# Altium schematic sheet SUBBOARD-phase_leg_3p_2L.SchDoc
size A4
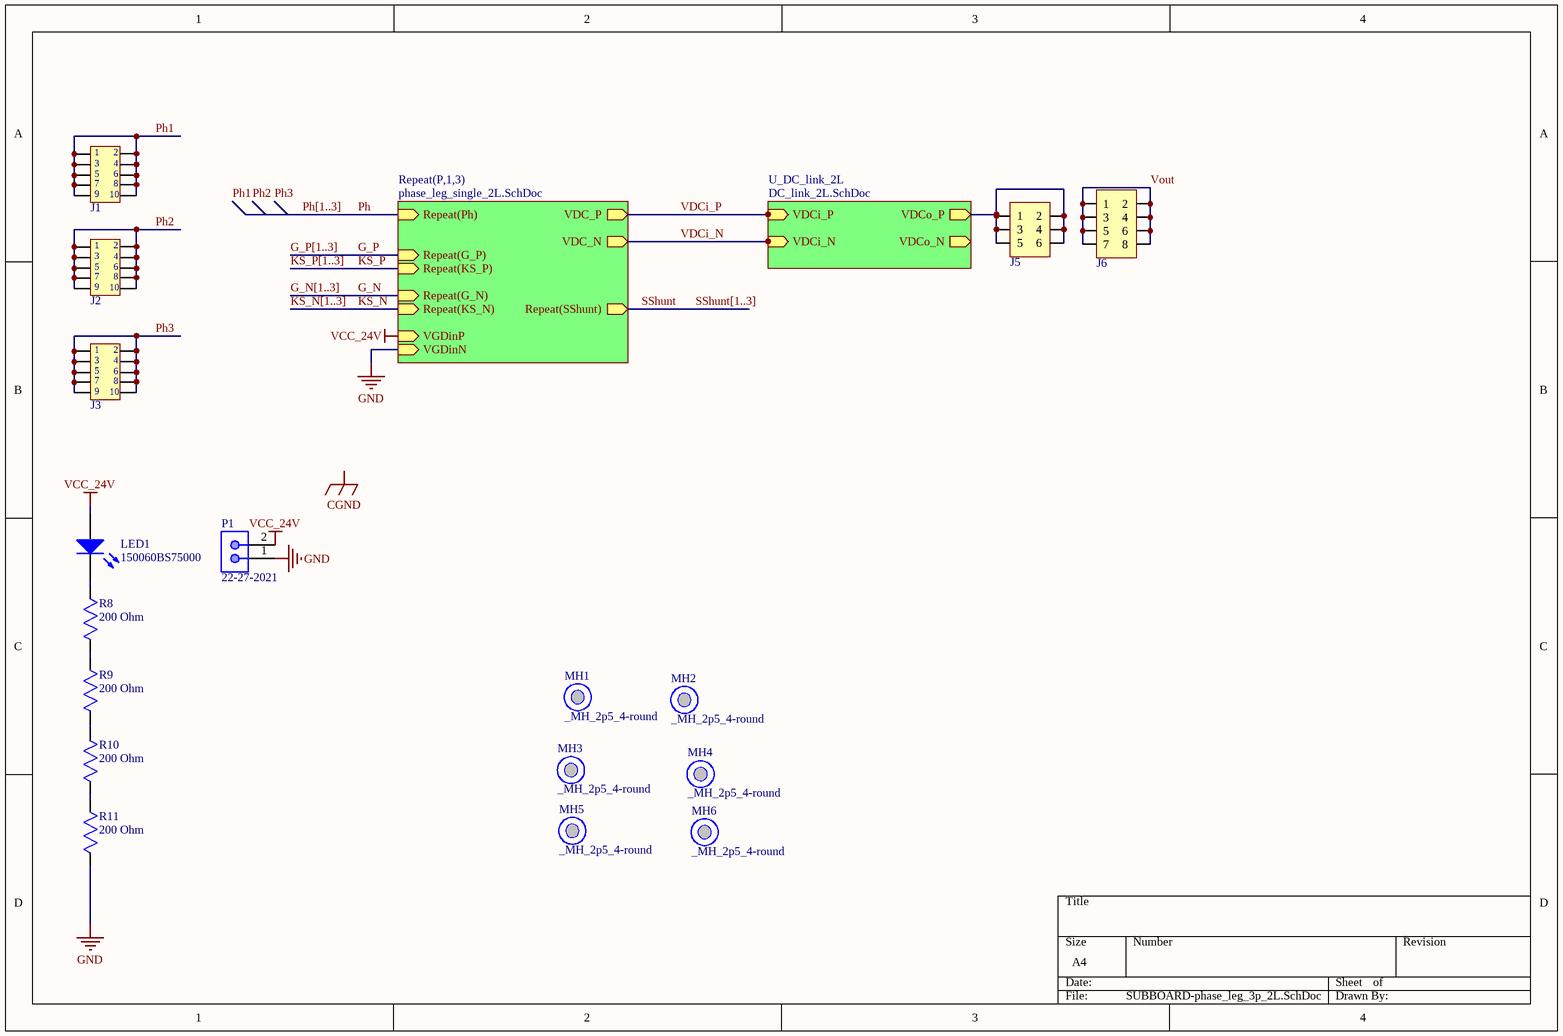
[diagram p0: SUBBOARD-phase_leg_3p_2L.SchDoc]

## Parts
J1  IPS1-105-01-L-D-RA  [IPS1-105-01-L-D-RA]  (value not drawn)
J2  IPS1-105-01-L-D-RA  [IPS1-105-01-L-D-RA]  (value not drawn)
J3  IPS1-105-01-L-D-RA  [IPS1-105-01-L-D-RA]  (value not drawn)
J5  SSW-103-01-G-D  [SSW-103-01-G-D]  (value not drawn)
J6  SSW-104-01-G-D  [SSW-104-01-G-D]  (value not drawn)
LED1  150060BS75000  [0603_A]
MH1  _MH_2p5_4-round  [_MH_2p5_4-round]
MH2  _MH_2p5_4-round  [_MH_2p5_4-round]
MH3  _MH_2p5_4-round  [_MH_2p5_4-round]
MH4  _MH_2p5_4-round  [_MH_2p5_4-round]
MH5  _MH_2p5_4-round  [_MH_2p5_4-round]
MH6  _MH_2p5_4-round  [_MH_2p5_4-round]
P1  22-27-2021  [MOLX-22-27-2021_V]
R8  200 Ohm  [CRCW0603200RFKEAHP]
R9  200 Ohm  [CRCW0603200RFKEAHP]
R10  200 Ohm  [CRCW0603200RFKEAHP]
R11  200 Ohm  [CRCW0603200RFKEAHP]

## Sub-sheets
Repeat(P,1,3) = phase_leg_single_2L.SchDoc: VDC_P (out), VDC_N (out), Repeat(Ph) (in), Repeat(G_P) (in), Repeat(KS_P) (in), Repeat(G_N) (in), Repeat(KS_N) (in), Repeat(SShunt) (out), VGDinP (in), VGDinN (in)
U_DC_link_2L = DC_link_2L.SchDoc: VDCo_P (out), VDCo_N (out), VDCi_P (in), VDCi_N (in)

## Nets
GND: P1.1 R11.2 ; sheet Repeat(P,1,3)/VGDinN
VCC_24V: LED1.2(A) P1.2 ; sheet Repeat(P,1,3)/VGDinP
G_N: sheet Repeat(P,1,3)/Repeat(G_N)
G_P: sheet Repeat(P,1,3)/Repeat(G_P)
KS_N: sheet Repeat(P,1,3)/Repeat(KS_N)
KS_P: sheet Repeat(P,1,3)/Repeat(KS_P)
Ph: sheet Repeat(P,1,3)/Repeat(Ph)
Ph1: J1.1 J1.2 J1.3 J1.4 J1.5 J1.6 J1.7 J1.8 J1.9 J1.10
Ph2: J2.1 J2.2 J2.3 J2.4 J2.5 J2.6 J2.7 J2.8 J2.9 J2.10
Ph3: J3.1 J3.2 J3.3 J3.4 J3.5 J3.6 J3.7 J3.8 J3.9 J3.10
SShunt: sheet Repeat(P,1,3)/Repeat(SShunt)
VDCi_N: sheet U_DC_link_2L/VDCi_N, sheet Repeat(P,1,3)/VDC_N
VDCi_P: sheet U_DC_link_2L/VDCi_P, sheet Repeat(P,1,3)/VDC_P
Vout: J6.1 J6.2 J6.3 J6.4 J6.5 J6.6 J6.7 J6.8
NetJ5_1: J5.1 J5.2 J5.3 J5.4 J5.5 J5.6 ; sheet U_DC_link_2L/VDCo_P
NetLED1_1: LED1.1(K) R8.1
NetR8_2: R8.2 R9.1
NetR9_2: R9.2 R10.1
NetR10_2: R10.2 R11.1

## Buses and harness runs
bus G_N[1..3]
bus G_P[1..3]
bus KS_N[1..3]
bus KS_P[1..3]
bus Ph[1..3]
bus SShunt[1..3]

## Notes on the sheet
- Labels drawn without touching a wire or pin: CGND, Ph1, Ph2, Ph3

## Library data of the parts
J1-J3 = IPS1-105-01-L-D-RA: SAMTEC         IPS1-105-01-L-D-RA             Board-To-Board Connector, Right Angle, IPS1 Series, 10 Contacts, Receptacle, 2.54 mm, Through Hole; Number of Contacts: 10; Number of Ports: 1; Max Voltage Rating (AC): 550V; Current Rating: 9A; Voltage Rating: 777V; Pitch: 2.54mm; Supplier 1: Digi-Key; Manufacturer: Samtec; Manufacturer Part Number: IPS1-105-01-L-D-RA; RoHS: Yes; Category: Connectors; Stock 1: 364; Pricing 1: 1=2.75000, 10=2.64000, 100=2.20000, 500=1.87000, 1000=1.59500, 5000=1.43000 (USD); Mount: Through Hole,Surface Mount; Number of Terminals: 10; Contact Material: Bronze; Contact Plating: Gold; Housing Material: Polymer; Min Operating Temperature: -55°C; Max Operating Temperature: 125°C; Termination: Solder; Orientation: Right Angle; Packaging: Bulk; Gender: Receptacle; Number of Rows: 2; Length: 13.08mm; Depth: 8.51mm; Radiation Hardening: No; REACH SVHC: No SVHC; ComponentLink1URL: https://datasheet.ciiva.com/25618/0900766b8114c2ed-25618027.pdf?src-supplier=RSComponents; ComponentLink1Description: https://datasheet.ciiva.com/25618/0900766b8114c2ed-25618027.pdf?src-supplier=RSComponents; ComponentLink2URL: https://datasheet.ciiva.com/9444/ipt1-9444586.pdf?src-supplier=Avnet; ComponentLink2Description: https://datasheet.ciiva.com/9444/ipt1-9444586.pdf?src-supplier=Avnet; Supplier Part Number 1: SAM9620-ND
J5 = SSW-103-01-G-D: Conn Socket Strip SKT 6 POS 2.54mm Solder ST Thru-Hole; Manufacturer: Samtec; Number of Contacts: 6; Gender: Receptacle; Connector Type: Receptacle,Socket; Contact Resistance: 10mR; Max Current Rating: 6.9A; Max Voltage Rating (AC): 550V; Mating Cycles: 100; Row Spacing: 0.1inch; Supplier 1: Digi-Key; Manufacturer Part Number: SSW-103-01-G-D; RoHS: Yes; Category: Headers and Wire Housings; Stock 1: 1397; Pricing 1: 1=0.93000, 10=0.82100, 25=0.77240, 50=0.74020, 100=0.70800, 250=0.64368, 500=0.57932 (USD); Mount: Through Hole; Contact Plating: Gold; Contact Material: Bronze; Color: Black; Housing Color: Black; Housing Material: Polymer; Min Operating Temperature: -55°C; Max Operating Temperature: 125°C; Number of Rows: 2; Termination: Solder; Packaging: Bulk; Number of Positions: 6; Orientation: Vertical; Current Rating: 6.9A; Voltage Rating: 550V; Length: 8.13mm; Pitch: 2.54mm; Depth: 4.95mm; Radiation Hardening: No; Lead Free: Lead Free; REACH SVHC: No SVHC; ComponentLink1URL: https://datasheet.ciiva.com/25617/0900766b8115c03d-25617399.pdf?src-supplier=RSComponents; ComponentLink1Description: https://datasheet.ciiva.com/25617/0900766b8115c03d-25617399.pdf?src-supplier=RSComponents; ComponentLink2URL: https://datasheet.ciiva.com/22677/82032-22677622.pdf?src-supplier=Element14; ComponentLink2Description: https://datasheet.ciiva.com/22677/82032-22677622.pdf?src-supplier=Element14; ComponentLink3URL: https://datasheet.ciiva.com/749/ssw-1xx-xx-xxx-x-xx-xxx-xx-mkt-749828.pdf?src-supplier=Digi-Key; ComponentLink3Description: https://datasheet.ciiva.com/749/ssw-1xx-xx-xxx-x-xx-xxx-xx-mkt-749828.pdf?src-supplier=Digi-Key; Supplier Part Number 1: SAM1208-03-ND; Supplier 2: Arrow; Stock 2: 1; Pricing 2: 1=0.94640, 1=0.93000, 4167=0.71590, 8334=0.59720, 41667=0.52200, 83334=0.49330 (USD); Supplier 3: Mouser; Stock 3: 388; Pricing 3: 1=1.35000, 10=1.10000, 100=0.98200, 250=0.91700, 500=0.79200, 1000=0.69000 (USD); Supplier Part Number 2: SSW-103-01-G-D; Supplier Part Number 3: 200-SSW10301GD
J6 = SSW-104-01-G-D: Conn Socket Strip SKT 8 POS 2.54mm Solder ST Thru-Hole; Manufacturer: Samtec; Number of Contacts: 8; Max Current Rating: 6.9A; Contact Resistance: 10mR; Max Voltage Rating (AC): 550V; Gender: Receptacle; Connector Type: Receptacle,Socket; Mating Cycles: 100; Row Spacing: 0.1inch; Supplier 1: Digi-Key; Manufacturer Part Number: SSW-104-01-G-D; RoHS: Yes; Category: Headers and Wire Housings; Stock 1: 1152; Pricing 1: 1=1.24000, 10=1.09400, 25=1.03000, 50=0.98700, 100=0.94410, 250=0.85824, 500=0.77242 (USD); Mount: Through Hole; Contact Plating: Gold; Contact Material: Bronze; Color: Black; Housing Color: Black; Housing Material: Polymer; Min Operating Temperature: -55°C; Max Operating Temperature: 125°C; Number of Rows: 2; Termination: Solder; Packaging: Bulk; Orientation: Vertical; Number of Positions: 8; Current Rating: 6.9A; Voltage Rating: 550V; Length: 10.67mm; Pitch: 2.54mm; Depth: 4.95mm; Radiation Hardening: No; Lead Free: Lead Free; REACH SVHC: No SVHC; ComponentLink1URL: https://datasheet.ciiva.com/25617/0900766b8115c03d-25617355.pdf?src-supplier=RSComponents; ComponentLink1Description: https://datasheet.ciiva.com/25617/0900766b8115c03d-25617355.pdf?src-supplier=RSComponents; ComponentLink2URL: https://datasheet.ciiva.com/22677/82032-22677624.pdf?src-supplier=Element14; ComponentLink2Description: https://datasheet.ciiva.com/22677/82032-22677624.pdf?src-supplier=Element14; ComponentLink3URL: https://datasheet.ciiva.com/749/ssw-1xx-xx-xxx-x-xx-xxx-xx-mkt-749827.pdf?src-supplier=Digi-Key; ComponentLink3Description: https://datasheet.ciiva.com/749/ssw-1xx-xx-xxx-x-xx-xxx-xx-mkt-749827.pdf?src-supplier=Digi-Key; Supplier Part Number 1: SAM1208-04-ND
LED1 = CMP-1426-00003-1: SMD mono-color Chip LED, WL-SMCW, Blue; Manufacturer: Wuerth Elektronik; Color: Blue; ComponentLink2Description: Datasheet; ComponentLink2URL: http://katalog.we-online.com/led/datasheet/150060BS75000.pdf; ComponentLink1URL: http://www.we-online.com; PackageReference: 0603_A; PartNumber: 150060BS75000; ComponentLink1Description: Manufacturer URL
MH1-MH6 = _MH_2p5_4-round: matching hole 2.5 hole, 4mm pad (round)
P1 = CMP-2000-05537-1: Male Header, Pitch 2.54 mm, 1 x 2 Position, Height 11.7 mm, Tail Length 3.56 mm, 0 to 75 degC, RoHS, Bulk; Manufacturer: Molex; PartNumber: 0022272021; Current rating: 4A; Package Version: Rev. BC, 02/2012; Voltage rating: 250V; No. of Positions: 2; Pitch: 2.54mm; No. of Rows: 1; Orientation: Vertical; Operating temperature: 0°Cto+75°C; Manufacturer URL: http://www.molex.com/; Mounting Technology: ThroughHole; Housing material: Nylon(UL94V-0); Package Description: 2-Leads Header, Body 5.08 x 5.8 mm, Pitch 2.54 mm; Voltage - Max: 250V; Datasheet URL: http://www.molex.com/pdm_docs/sd/022272021_sd.pdf; Package Reference: 22-27-2021; Contact material: Tinplatedbrass; Current - Max: 4A; Datasheet Version: Rev. F, 06/2009
R8-R11 = CRCW0603200RFKEAHP: CRCW0603200RFKEAHP / Res Thick Film 0603 200 Ohm 1% 0.25W(1/4W) ±100ppm/C Pad SMD Automotive T/R; Manufacturer: Vishay Dale; Resistance: 200R; Power Rating: 250mW; Temperature Coefficient: 100ppm/°C; Supplier 1: Digi-Key; Manufacturer Part Number: CRCW0603200RFKEAHP; RoHS: Yes; Category: Chip SMD Resistors; Stock 1: 59007; Pricing 1: 1=0.15000, 10=0.12900, 100=0.05030, 1000=0.02106, 2500=0.01930 (USD); Mount: Surface Mount; Case/Package: 0603; Case Code (Imperial): 0603; Case Code (Metric): 1608; Contact Plating: Tin; Min Operating Temperature: -55°C; Max Operating Temperature: 155°C; Features: Automotive AEC-Q200; Tolerance: 1%; Packaging: Tape and Reel; Resistor Type: Thick Film; Max Power Dissipation: 250mW; Number of Terminations: 2; Package Quantity: 5000; Length: 0.063inch; Width: 0.033inch; Height: 0.022inch; Radiation Hardening: No; Lead Free: Lead Free; ComponentLink1URL: https://datasheet.ciiva.com/2578/crcwhpe3-2578537.pdf?src-supplier=Digi-Key; ComponentLink1Description: https://datasheet.ciiva.com/2578/crcwhpe3-2578537.pdf?src-supplier=Digi-Key; ComponentLink2URL: https://datasheet.ciiva.com/8961/crcwhpe3-8961129.pdf?src-supplier=Avnet; ComponentLink2Description: https://datasheet.ciiva.com/8961/crcwhpe3-8961129.pdf?src-supplier=Avnet; Supplier Part Number 1: 541-200SCT-ND